# Altium schematic sheet TDisplay.SchDoc
size A2; Organization: Altium Limited; Address1: L3, 12a Rodborough Rd; Address2: Frenchs Forest; Address3: NSW; Address4: Australia 2086; DocumentNumber: 16; SheetNumber: 16; SheetTotal: 22
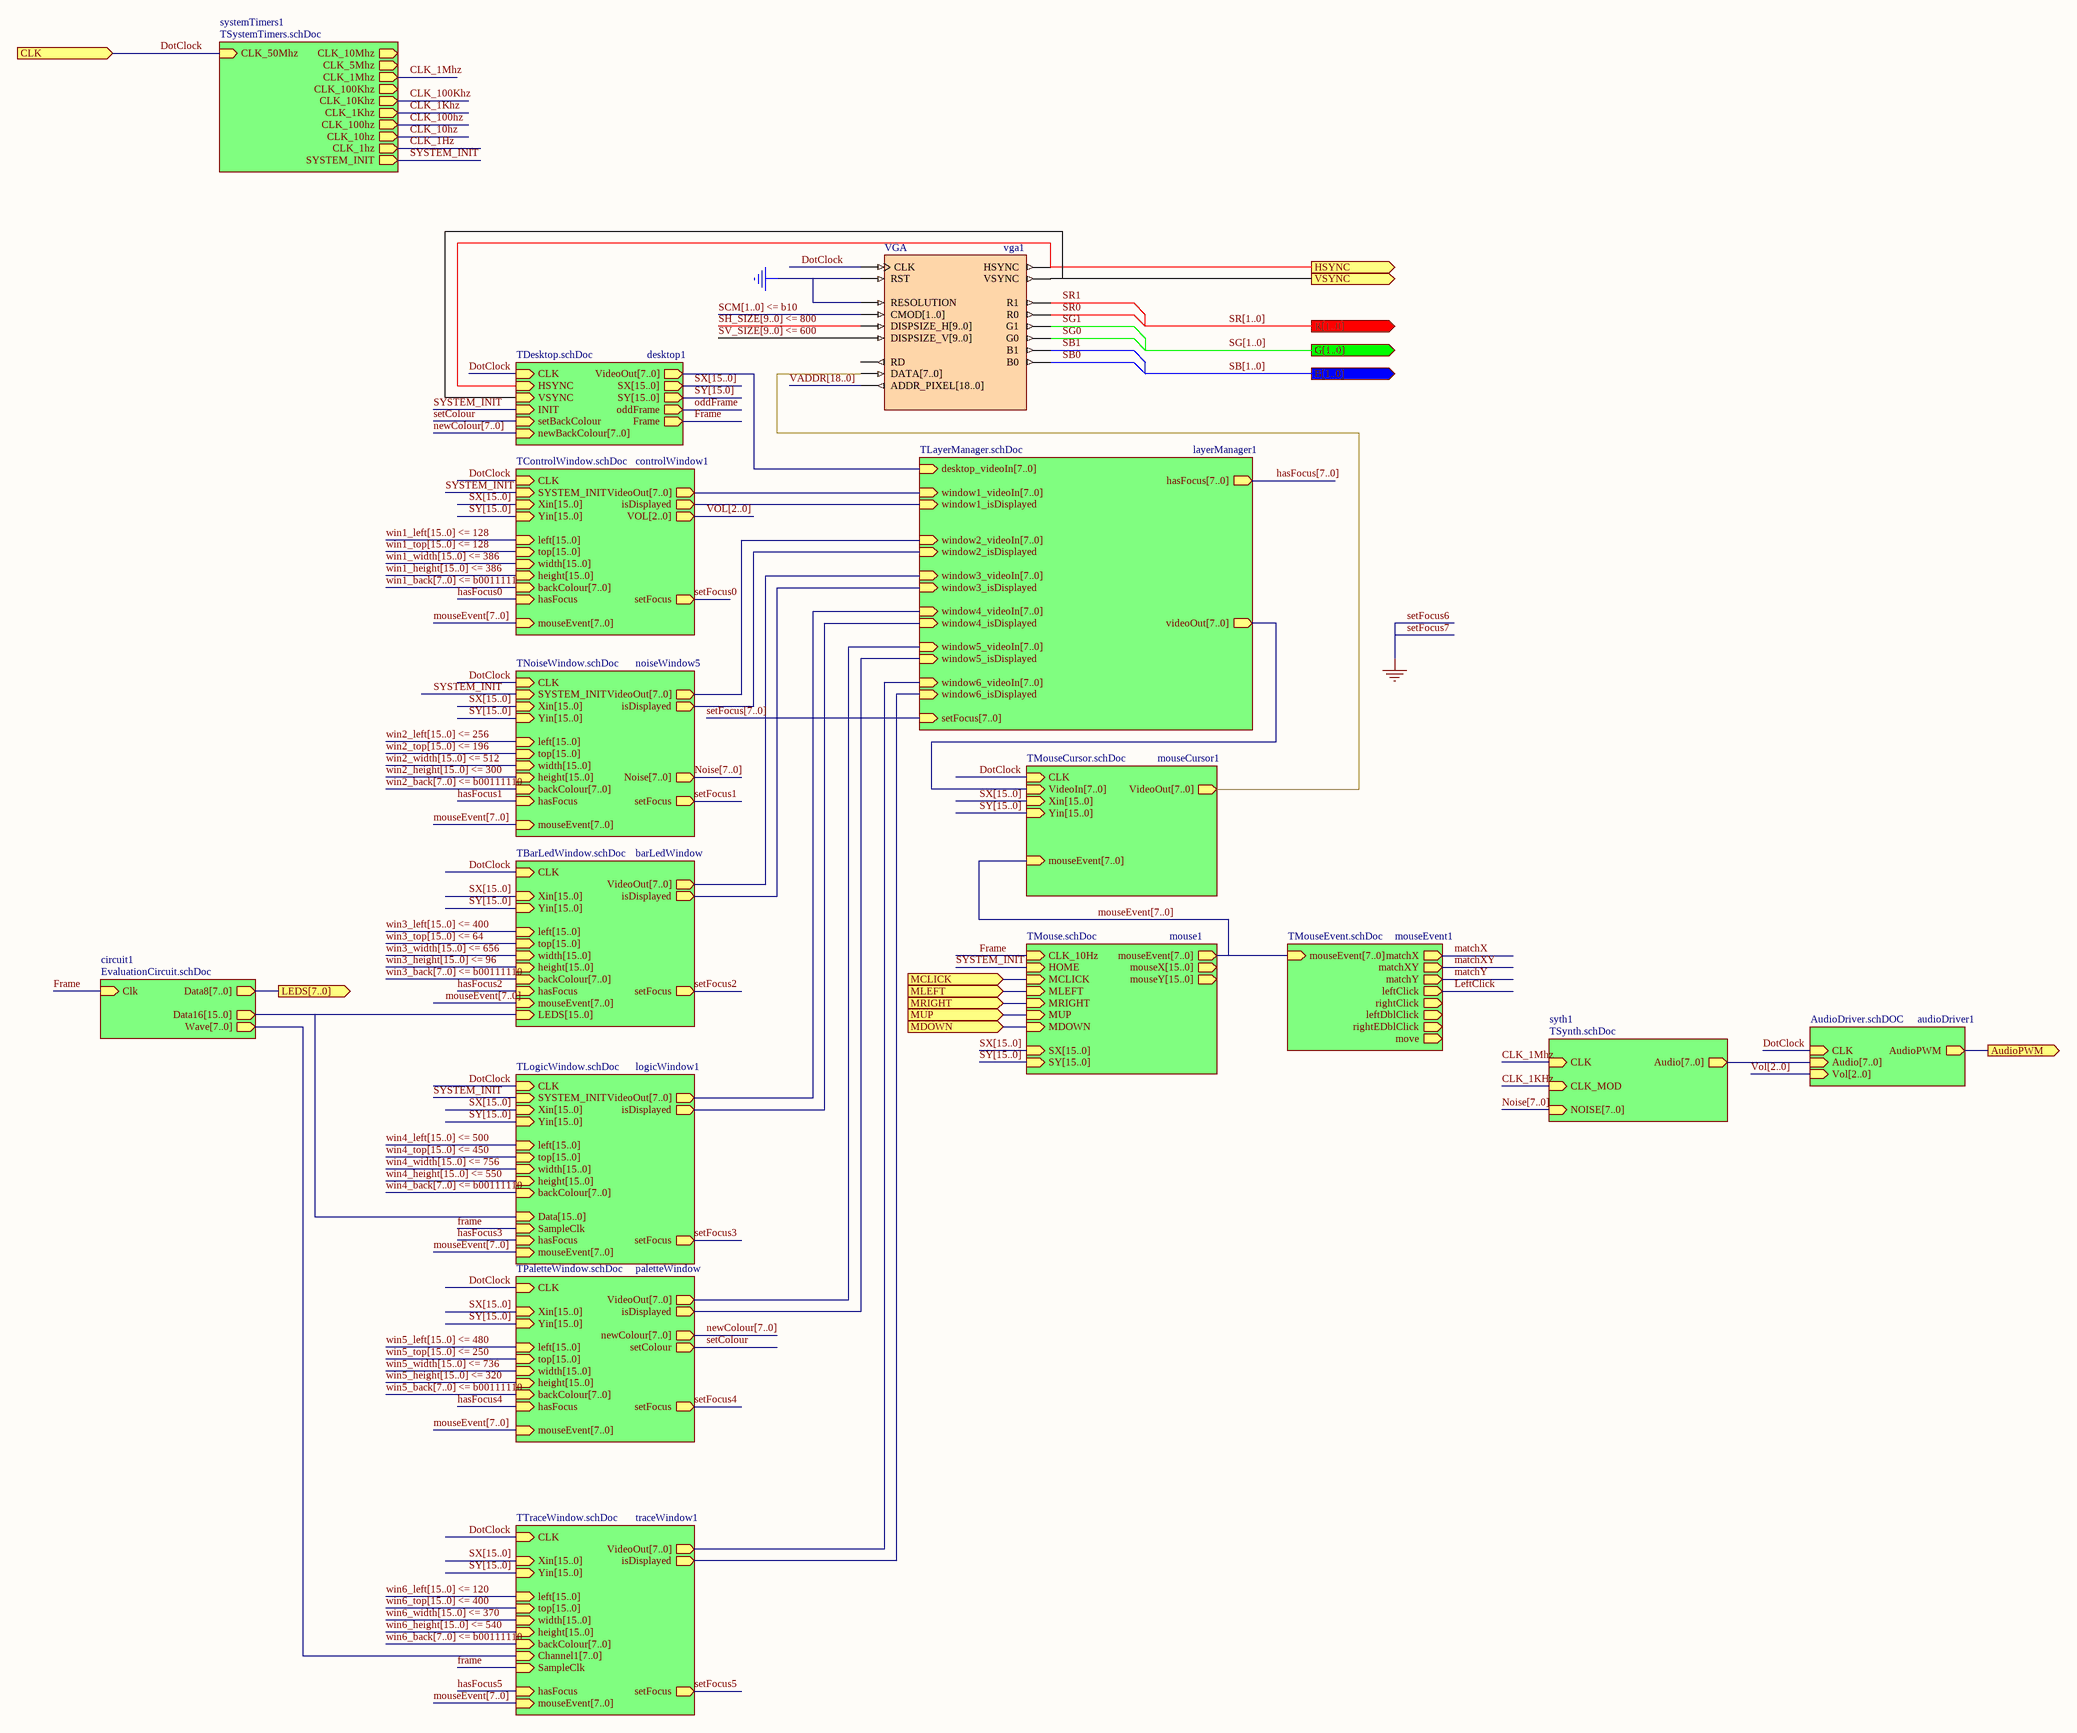
[diagram p0: TDisplay.SchDoc]

## Parts
vga1  VGA

## Sub-sheets
audioDriver1 = AudioDriver.schDOC: AudioPWM (out), CLK (in), Audio[7..0] (in), Vol[2..0] (in)
barLedWindow = TBarLedWindow.schDoc: CLK (in), VideoOut[7..0] (out), Xin[15..0] (in), Yin[15..0] (in), top[15..0] (in), width[15..0] (in), height[15..0] (in), left[15..0] (in), backColour[7..0] (in), LEDS[15..0] (in), isDisplayed (out), hasFocus (in), setFocus (out), mouseEvent[7..0] (in)
circuit1 = EvaluationCircuit.schDoc: Data16[15..0] (out), Clk (in), Data8[7..0] (out), Wave[7..0] (out)
controlWindow1 = TControlWindow.schDoc: CLK (in), VideoOut[7..0] (out), Xin[15..0] (in), Yin[15..0] (in), top[15..0] (in), width[15..0] (in), height[15..0] (in), left[15..0] (in), backColour[7..0] (in), isDisplayed (out), SYSTEM_INIT (in), hasFocus (in), setFocus (out), mouseEvent[7..0] (in), VOL[2..0] (out)
desktop1 = TDesktop.schDoc: CLK (in), VideoOut[7..0] (out), SX[15..0] (out), SY[15..0] (out), HSYNC (in), VSYNC (in), Frame (out), oddFrame (out), setBackColour (in), newBackColour[7..0] (in), INIT (in)
layerManager1 = TLayerManager.schDoc: window1_videoIn[7..0] (in), window2_videoIn[7..0] (in), window3_videoIn[7..0] (in), window1_isDisplayed (in), window2_isDisplayed (in), window3_isDisplayed (in), desktop_videoIn[7..0] (in), videoOut[7..0] (out), window5_videoIn[7..0] (in), window4_isDisplayed (in), window4_videoIn[7..0] (in), window5_isDisplayed (in), window6_videoIn[7..0] (in), window6_isDisplayed (in), hasFocus[7..0] (out), setFocus[7..0] (in)
logicWindow1 = TLogicWindow.schDoc: CLK (in), VideoOut[7..0] (out), Xin[15..0] (in), Yin[15..0] (in), top[15..0] (in), width[15..0] (in), height[15..0] (in), left[15..0] (in), backColour[7..0] (in), isDisplayed (out), SYSTEM_INIT (in), SampleClk (in), Data[15..0] (in), hasFocus (in), setFocus (out), mouseEvent[7..0] (in)
mouse1 = TMouse.schDoc: MCLICK (in), MLEFT (in), MRIGHT (in), MUP (in), MDOWN (in), mouseX[15..0] (out), mouseY[15..0] (out), CLK_10Hz (in), HOME (in), mouseEvent[7..0] (out), SX[15..0] (in), SY[15..0] (in)
mouseCursor1 = TMouseCursor.schDoc: CLK (in), VideoOut[7..0] (out), Xin[15..0] (in), Yin[15..0] (in), VideoIn[7..0] (in), mouseEvent[7..0] (in)
mouseEvent1 = TMouseEvent.schDoc: mouseEvent[7..0] (in), matchX (out), matchXY (out), matchY (out), leftClick (out), rightClick (out), leftDblClick (out), rightEDblClick (out), move (out)
noiseWindow5 = TNoiseWindow.schDoc: CLK (in), VideoOut[7..0] (out), Xin[15..0] (in), Yin[15..0] (in), top[15..0] (in), width[15..0] (in), height[15..0] (in), left[15..0] (in), backColour[7..0] (in), isDisplayed (out), SYSTEM_INIT (in), hasFocus (in), setFocus (out), Noise[7..0] (out), mouseEvent[7..0] (in)
paletteWindow = TPaletteWindow.schDoc: CLK (in), VideoOut[7..0] (out), Xin[15..0] (in), Yin[15..0] (in), top[15..0] (in), width[15..0] (in), height[15..0] (in), left[15..0] (in), backColour[7..0] (in), isDisplayed (out), setColour (out), newColour[7..0] (out), mouseEvent[7..0] (in), hasFocus (in), setFocus (out)
systemTimers1 = TSystemTimers.schDoc: CLK_50Mhz (in), CLK_10Mhz (out), CLK_1Mhz (out), CLK_100Khz (out), CLK_10Khz (out), CLK_1Khz (out), CLK_100hz (out), CLK_10hz (out), CLK_1hz (out), SYSTEM_INIT (out), CLK_5Mhz (out)
syth1 = TSynth.schDoc: CLK (in), CLK_MOD (in), Audio[7..0] (out), NOISE[7..0] (in)
traceWindow1 = TTraceWindow.schDoc: CLK (in), VideoOut[7..0] (out), Xin[15..0] (in), Yin[15..0] (in), top[15..0] (in), width[15..0] (in), height[15..0] (in), left[15..0] (in), backColour[7..0] (in), isDisplayed (out), SampleClk (in), Channel1[7..0] (in), hasFocus (in), setFocus (out), mouseEvent[7..0] (in)

## Ports
AudioPWM (out), B[1..0] (out), CLK (in), G[1..0] (out), HSYNC (out), LEDS[7..0] (out), MCLICK (in), MDOWN (in), MLEFT (in), MRIGHT (in), MUP (in), R[1..0] (out), VSYNC (out)

## Nets
setFocus6: vga1.RESOLUTION vga1.RST  [also labelled GND, setFocus7]
AudioPWM: port AudioPWM, sheet audioDriver1/AudioPWM
CLK_1Hz: sheet systemTimers1/CLK_1hz
CLK_1KHz: sheet systemTimers1/CLK_1Khz, sheet syth1/CLK_MOD
CLK_1Mhz: sheet systemTimers1/CLK_1Mhz, sheet syth1/CLK
CLK_10hz: sheet systemTimers1/CLK_10hz
CLK_100hz: sheet systemTimers1/CLK_100hz
CLK_100Khz: sheet systemTimers1/CLK_10Khz
DotClock: vga1.CLK ; port CLK, sheet noiseWindow5/CLK, sheet mouseCursor1/CLK, sheet barLedWindow/CLK, sheet desktop1/CLK, sheet systemTimers1/CLK_50Mhz, sheet logicWindow1/CLK, sheet paletteWindow/CLK, sheet traceWindow1/CLK, sheet audioDriver1/CLK, sheet controlWindow1/CLK
Frame: sheet desktop1/Frame, sheet mouse1/CLK_10Hz, sheet logicWindow1/SampleClk, sheet traceWindow1/SampleClk, sheet circuit1/Clk
hasFocus0: sheet controlWindow1/hasFocus
hasFocus1: sheet noiseWindow5/hasFocus
hasFocus2: sheet barLedWindow/hasFocus
hasFocus3: sheet logicWindow1/hasFocus
hasFocus4: sheet paletteWindow/hasFocus
hasFocus5: sheet traceWindow1/hasFocus
HSYNC: vga1.HSYNC ; port HSYNC, sheet desktop1/HSYNC
LeftClick: sheet mouseEvent1/leftClick
matchX: sheet mouseEvent1/matchX
matchXY: sheet mouseEvent1/matchXY
matchY: sheet mouseEvent1/matchY
MCLICK: port MCLICK, sheet mouse1/MCLICK
MDOWN: port MDOWN, sheet mouse1/MDOWN
MLEFT: port MLEFT, sheet mouse1/MLEFT
MRIGHT: port MRIGHT, sheet mouse1/MRIGHT
MUP: port MUP, sheet mouse1/MUP
oddFrame: sheet desktop1/oddFrame
SB0: vga1.B0
SB1: vga1.B1
SCM[1..0] <= b10: vga1.CMOD[1..0]
setColour: sheet desktop1/setBackColour, sheet paletteWindow/setColour
setFocus0: sheet controlWindow1/setFocus
setFocus1: sheet noiseWindow5/setFocus
setFocus2: sheet barLedWindow/setFocus
setFocus3: sheet logicWindow1/setFocus
setFocus4: sheet paletteWindow/setFocus
setFocus5: sheet traceWindow1/setFocus
SG0: vga1.G0
SG1: vga1.G1
SH_SIZE[9..0] <= 800: vga1.DISPSIZE_H[9..0]
SR0: vga1.R0
SR1: vga1.R1
SV_SIZE[9..0] <= 600: vga1.DISPSIZE_V[9..0]
SYSTEM_INIT: sheet noiseWindow5/SYSTEM_INIT, sheet desktop1/INIT, sheet mouse1/HOME, sheet systemTimers1/SYSTEM_INIT, sheet logicWindow1/SYSTEM_INIT, sheet controlWindow1/SYSTEM_INIT
VADDR[18..0]: vga1.ADDR_PIXEL[18..0]
VSYNC: vga1.VSYNC ; port VSYNC, sheet desktop1/VSYNC
Netvga1_DATA[7..0]: vga1.DATA[7..0] ; sheet mouseCursor1/VideoOut[7..0]
(unnamed): sheet noiseWindow5/isDisplayed, sheet layerManager1/window2_isDisplayed
(unnamed): sheet barLedWindow/isDisplayed, sheet layerManager1/window3_isDisplayed
(unnamed): sheet layerManager1/window1_isDisplayed, sheet controlWindow1/isDisplayed
(unnamed): sheet layerManager1/window4_isDisplayed, sheet logicWindow1/isDisplayed
(unnamed): sheet layerManager1/window5_isDisplayed, sheet paletteWindow/isDisplayed
(unnamed): sheet layerManager1/window6_isDisplayed, sheet traceWindow1/isDisplayed

Not connected (* = marked no-connect by the designer): vga1 RD

## Buses and harness runs
bus hasFocus[7..0] = sheet layerManager1/hasFocus[7..0]
bus mouseEvent[7..0] = sheet barLedWindow/mouseEvent[7..0]
bus mouseEvent[7..0] = sheet controlWindow1/mouseEvent[7..0]
bus mouseEvent[7..0] = sheet logicWindow1/mouseEvent[7..0]
bus mouseEvent[7..0] = sheet mouse1/mouseEvent[7..0] = sheet mouseCursor1/mouseEvent[7..0] = sheet mouseEvent1/mouseEvent[7..0]
bus mouseEvent[7..0] = sheet noiseWindow5/mouseEvent[7..0]
bus mouseEvent[7..0] = sheet paletteWindow/mouseEvent[7..0]
bus mouseEvent[7..0] = sheet traceWindow1/mouseEvent[7..0]
bus newColour[7..0] = sheet desktop1/newBackColour[7..0]
bus newColour[7..0] = sheet paletteWindow/newColour[7..0]
bus Noise[7..0] = sheet noiseWindow5/Noise[7..0]
bus Noise[7..0] = sheet syth1/NOISE[7..0]
bus port LEDS[7..0] = sheet circuit1/Data8[7..0]
bus SB[1..0] = port B[1..0]
bus SCM[1..0] <= b10
bus setFocus[7..0] = sheet layerManager1/setFocus[7..0]
bus SG[1..0] = port G[1..0]
bus SH_SIZE[9..0] <= 800
bus sheet audioDriver1/Audio[7..0] = sheet syth1/Audio[7..0]
bus sheet barLedWindow/LEDS[15..0] = sheet circuit1/Data16[15..0] = sheet logicWindow1/Data[15..0]
bus sheet barLedWindow/VideoOut[7..0] = sheet layerManager1/window3_videoIn[7..0]
bus sheet circuit1/Wave[7..0] = sheet traceWindow1/Channel1[7..0]
bus sheet controlWindow1/VideoOut[7..0] = sheet layerManager1/window1_videoIn[7..0]
bus sheet desktop1/VideoOut[7..0] = sheet layerManager1/desktop_videoIn[7..0]
bus sheet layerManager1/videoOut[7..0] = sheet mouseCursor1/VideoIn[7..0]
bus sheet layerManager1/window2_videoIn[7..0] = sheet noiseWindow5/VideoOut[7..0]
bus sheet layerManager1/window4_videoIn[7..0] = sheet logicWindow1/VideoOut[7..0]
bus sheet layerManager1/window5_videoIn[7..0] = sheet paletteWindow/VideoOut[7..0]
bus sheet layerManager1/window6_videoIn[7..0] = sheet traceWindow1/VideoOut[7..0]
bus SR[1..0] = port R[1..0]
bus SV_SIZE[9..0] <= 600
bus SX[15..0] = sheet barLedWindow/Xin[15..0]
bus SX[15..0] = sheet controlWindow1/Xin[15..0]
bus SX[15..0] = sheet desktop1/SX[15..0]
bus SX[15..0] = sheet logicWindow1/Xin[15..0]
bus SX[15..0] = sheet mouse1/SX[15..0]
bus SX[15..0] = sheet mouseCursor1/Xin[15..0]
bus SX[15..0] = sheet noiseWindow5/Xin[15..0]
bus SX[15..0] = sheet paletteWindow/Xin[15..0]
bus SX[15..0] = sheet traceWindow1/Xin[15..0]
bus SY[15.0] = sheet desktop1/SY[15..0]
bus SY[15..0] = sheet barLedWindow/Yin[15..0]
bus SY[15..0] = sheet controlWindow1/Yin[15..0]
bus SY[15..0] = sheet logicWindow1/Yin[15..0]
bus SY[15..0] = sheet mouse1/SY[15..0]
bus SY[15..0] = sheet mouseCursor1/Yin[15..0]
bus SY[15..0] = sheet noiseWindow5/Yin[15..0]
bus SY[15..0] = sheet paletteWindow/Yin[15..0]
bus SY[15..0] = sheet traceWindow1/Yin[15..0]
bus VADDR[18..0]
bus Vol[2..0] = sheet audioDriver1/Vol[2..0]
bus VOL[2..0] = sheet controlWindow1/VOL[2..0]
bus win1_back[7..0] <= b00111110 = sheet controlWindow1/backColour[7..0]
bus win1_height[15..0] <= 386 = sheet controlWindow1/height[15..0]
bus win1_left[15..0] <= 128 = sheet controlWindow1/left[15..0]
bus win1_top[15..0] <= 128 = sheet controlWindow1/top[15..0]
bus win1_width[15..0] <= 386 = sheet controlWindow1/width[15..0]
bus win2_back[7..0] <= b00111110 = sheet noiseWindow5/backColour[7..0]
bus win2_height[15..0] <= 300 = sheet noiseWindow5/height[15..0]
bus win2_left[15..0] <= 256 = sheet noiseWindow5/left[15..0]
bus win2_top[15..0] <= 196 = sheet noiseWindow5/top[15..0]
bus win2_width[15..0] <= 512 = sheet noiseWindow5/width[15..0]
bus win3_back[7..0] <= b00111110 = sheet barLedWindow/backColour[7..0]
bus win3_height[15..0] <= 96 = sheet barLedWindow/height[15..0]
bus win3_left[15..0] <= 400 = sheet barLedWindow/left[15..0]
bus win3_top[15..0] <= 64 = sheet barLedWindow/top[15..0]
bus win3_width[15..0] <= 656 = sheet barLedWindow/width[15..0]
bus win4_back[7..0] <= b00111110 = sheet logicWindow1/backColour[7..0]
bus win4_height[15..0] <= 550 = sheet logicWindow1/height[15..0]
bus win4_left[15..0] <= 500 = sheet logicWindow1/left[15..0]
bus win4_top[15..0] <= 450 = sheet logicWindow1/top[15..0]
bus win4_width[15..0] <= 756 = sheet logicWindow1/width[15..0]
bus win5_back[7..0] <= b00111110 = sheet paletteWindow/backColour[7..0]
bus win5_height[15..0] <= 320 = sheet paletteWindow/height[15..0]
bus win5_left[15..0] <= 480 = sheet paletteWindow/left[15..0]
bus win5_top[15..0] <= 250 = sheet paletteWindow/top[15..0]
bus win5_width[15..0] <= 736 = sheet paletteWindow/width[15..0]
bus win6_back[7..0] <= b00111110 = sheet traceWindow1/backColour[7..0]
bus win6_height[15..0] <= 540 = sheet traceWindow1/height[15..0]
bus win6_left[15..0] <= 120 = sheet traceWindow1/left[15..0]
bus win6_top[15..0] <= 400 = sheet traceWindow1/top[15..0]
bus win6_width[15..0] <= 370 = sheet traceWindow1/width[15..0]

## Notes on the sheet
- Title
- Size:
- Date:
- File:
- A2
- Number:
- Time:
- Revision:
- Sheet
- of

## Library data of the parts
vga1 = VGA: VGA Controller; Published: 20/10/2003; Publisher: Altium Hobart Technology Centre; Core Revision: 1.00.00